# EAGLE design Quad (EAGLE 9.3.1)

## Sheet 1 of 2
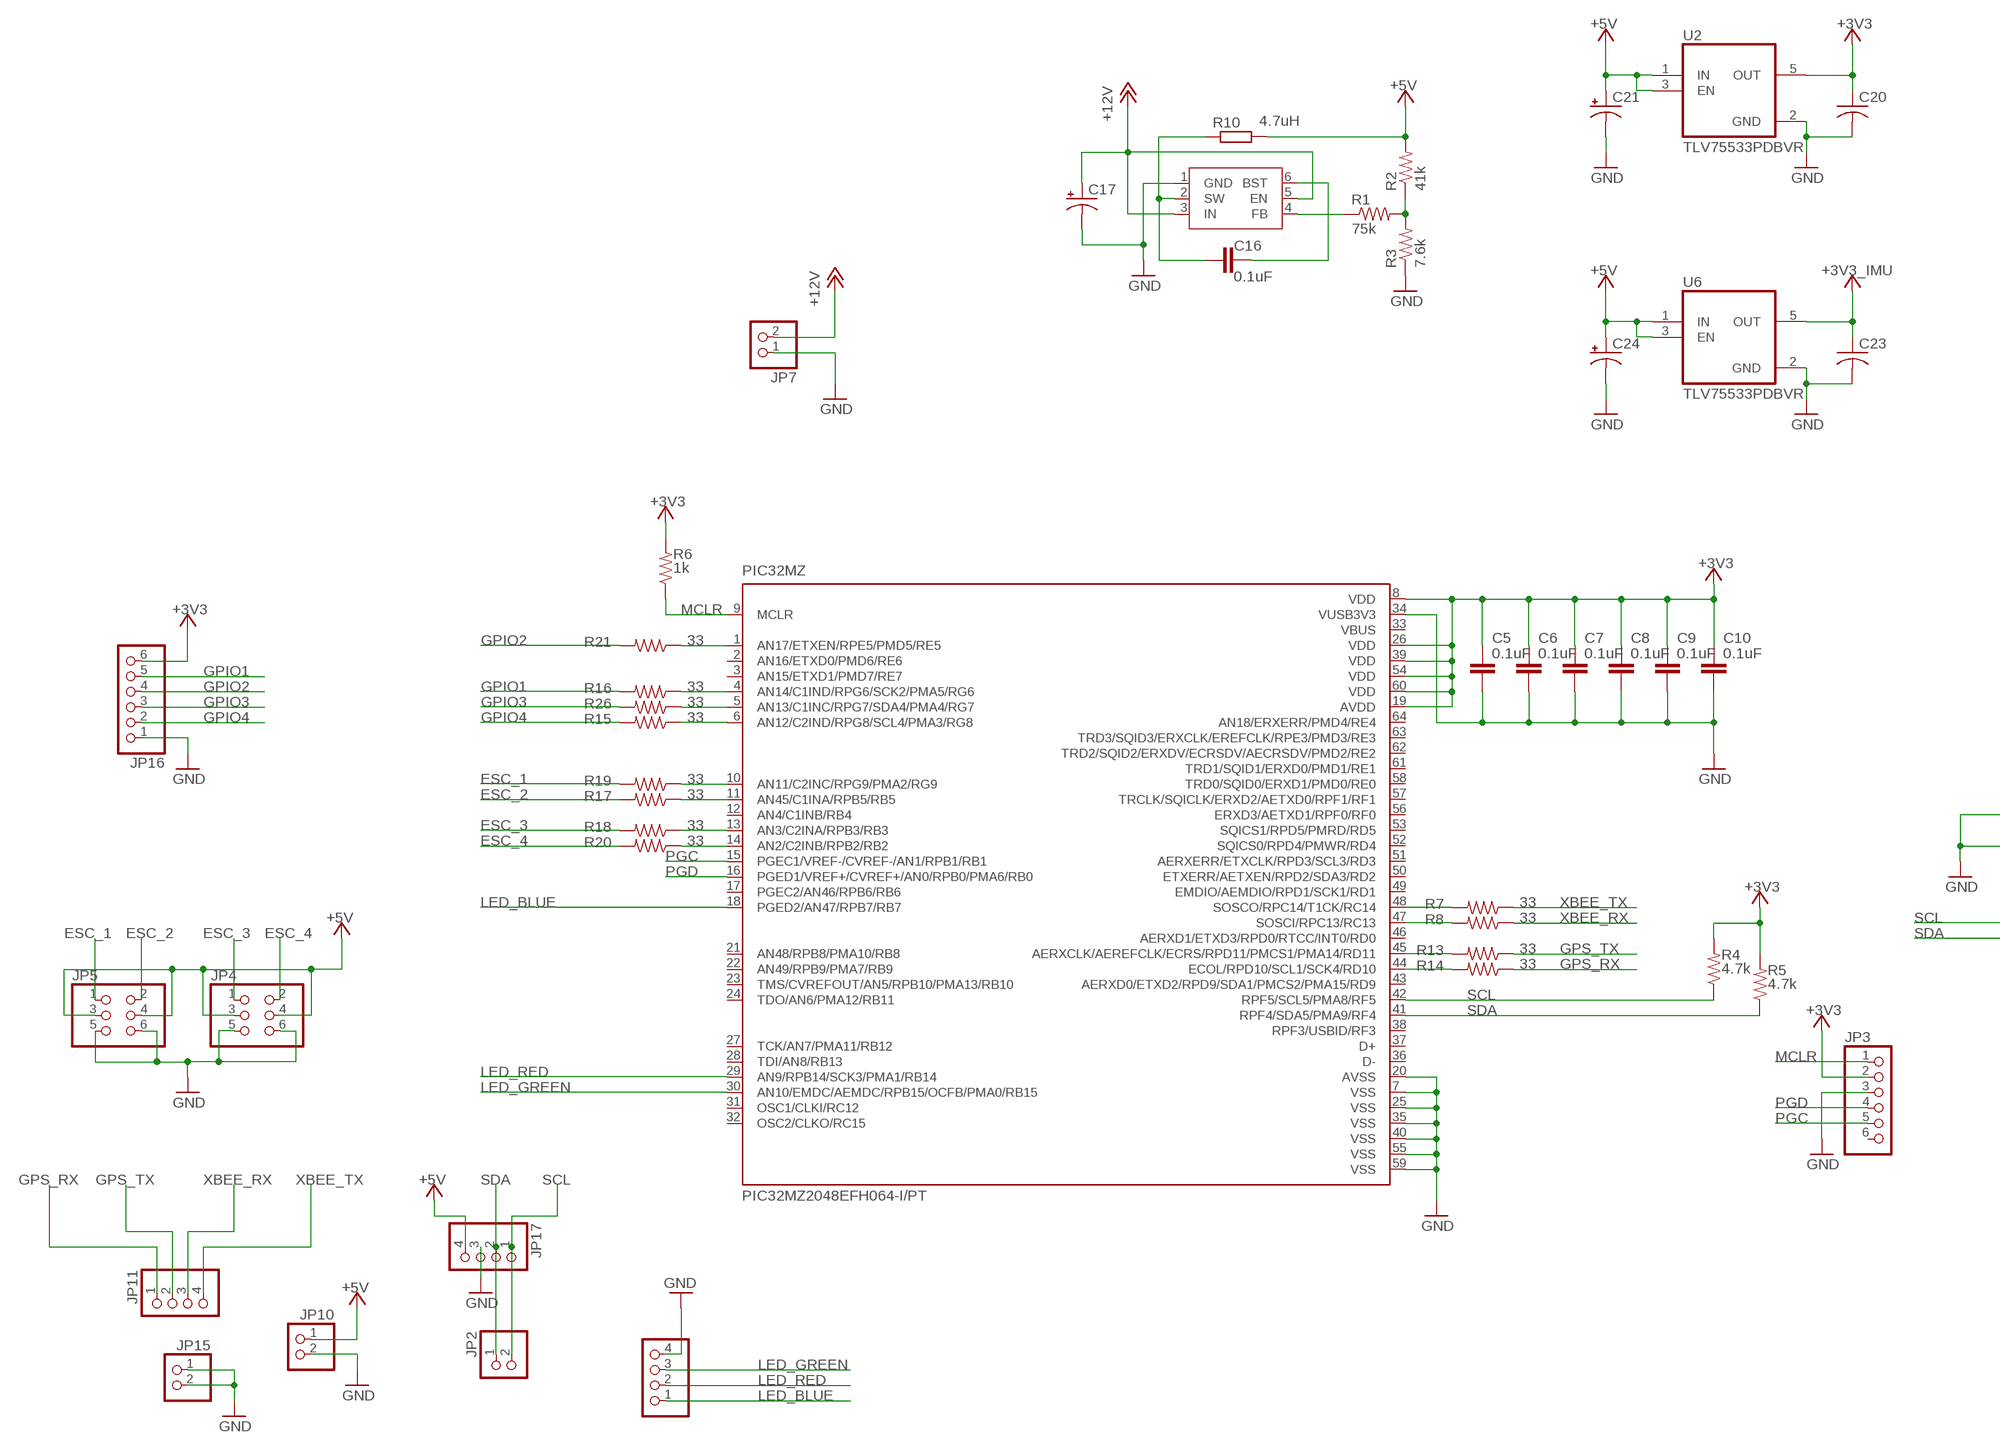
[diagram p0: schematic, sheet 1, part 1 of 2]
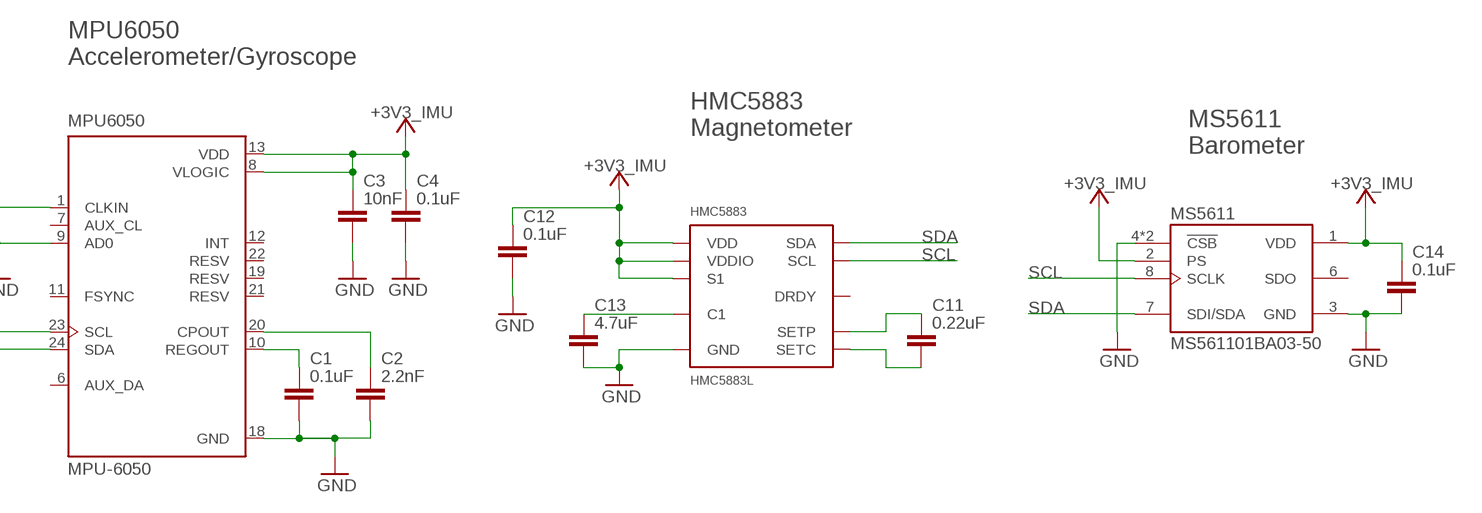
[diagram p1: schematic, sheet 1, part 2 of 2]

### Parts
C1  0.1uF  C-EUC0603  [C0603]
C2  2.2nF  C-EUC0603  [C0603]
C3  10nF  C-EUC0603  [C0603]
C4  0.1uF  C-EUC0603  [C0603]
C5  0.1uF  C-EUC0603  [C0603]
C6  0.1uF  C-EUC0603  [C0603]
C7  0.1uF  C-EUC0603  [C0603]
C8  0.1uF  C-EUC0603  [C0603]
C9  0.1uF  C-EUC0603  [C0603]
C10  0.1uF  C-EUC0603  [C0603]
C11  0.22uF  C-EUC0603  [C0603]
C12  0.1uF  C-EUC0603  [C0603]
C13  4.7uF  C-EUC0603  [C0603]
C14  0.1uF  C-EUC0603  [C0603]
C16  0.1uF  C-EUC0603  [C0603]
C17  CPOL-USC/6032-28R  [C/6032-28R]
C20  C-USC0805  [C0805]
C21  CPOL-USB/3528-21W  [B/3528-21W]
C23  C-USC0805  [C0805]
C24  CPOL-USB/3528-21W  [B/3528-21W]
HMC5883  HMC5883L  [LPCC-16]
JP2  PINHD-1X2  [1X02]
JP3  PINHD-1X6/90  [1X06/90]
JP4  PINHD-2X3  [2X03]
JP5  PINHD-2X3  [2X03]
JP7  PINHD-1X2/90  [1X02/90]
JP9  PINHD-1X4  [1X04]
JP10  PINHD-1X2  [1X02]
JP11  PINHD-1X4  [1X04]
JP15  PINHD-1X2  [1X02]
JP16  PINHD-1X6  [1X06]
JP17  PINHD-1X4/90  [1X04/90]
MPU6050  MPU-6050  [QFN50P400X400X95-24N]
MS5611  MS561101BA03-50  [SON125P500X300X100-8N]
PIC32MZ  PIC32MZ2048EFH064-I/PT  [QFP50P1200X1200X120-64N]
R1  75k  R-US_R0603  [R0603]
R2  41k  R-US_R0603  [R0603]
R3  7.6k  R-US_R0603  [R0603]
R4  4.7k  R-US_R0603  [R0603]
R5  4.7k  R-US_R0603  [R0603]
R6  1k  R-US_R0603  [R0603]
R7  33  R-US_R0603  [R0603]
R8  33  R-US_R0603  [R0603]
R10  4.7uH  R-EU_R0805  [R0805]
R13  33  R-US_R0603  [R0603]
R14  33  R-US_R0603  [R0603]
R15  33  R-US_R0603  [R0603]
R16  33  R-US_R0603  [R0603]
R17  33  R-US_R0603  [R0603]
R18  33  R-US_R0603  [R0603]
R19  33  R-US_R0603  [R0603]
R20  33  R-US_R0603  [R0603]
R21  33  R-US_R0603  [R0603]
R26  33  R-US_R0603  [R0603]
U2  TLV75533PDBVR  [SOT95P280X145-5N]
U6  TLV75533PDBVR  [SOT95P280X145-5N]
U$2  AP65211A  [SOT95P280X140-6N]

### Nets
+3V3: C5.1 C6.1 C7.1 C8.1 C9.1 C10.1 C20.1 JP3.2 JP16.6 PIC32MZ.8(VDD) PIC32MZ.19(AVDD) PIC32MZ.26(VDD) PIC32MZ.39(VDD) PIC32MZ.54(VDD) PIC32MZ.60(VDD) R4.2 R5.2 R6.2 U2.5(OUT)
+5V: C21.+ C24.+ JP4.3 JP4.4 JP5.3 JP5.4 JP10.1 JP17.4 R2.2 R10.2 U2.1(IN) U2.3(EN) U6.1(IN) U6.3(EN)
+12V: C17.+ JP7.2 U$2.3(IN) U$2.5(EN)
ESC_1: JP5.1 R19.2
ESC_2: JP5.2 R17.2
ESC_3: JP4.1 R18.2
ESC_4: JP4.2 R20.2
GND: C1.2 C2.2 C3.2 C4.2 C5.2 C6.2 C7.2 C8.2 C9.2 C10.2 C12.2 C13.2 C14.2 C17.- C20.2 C21.- C23.2 C24.- HMC5883.9(GND) HMC5883.11(GND) JP3.3 JP4.5 JP4.6 JP5.5 JP5.6 JP7.1 JP9.4 JP10.2 JP15.1 JP15.2 JP16.1 JP17.3 MPU6050.1(CLKIN) MPU6050.9(AD0) MPU6050.18(GND) MS5611.3(GND) MS5611.4(!CSB) MS5611.5(!CSB) PIC32MZ.7(VSS) PIC32MZ.20(AVSS) PIC32MZ.25(VSS) PIC32MZ.34(VUSB3V3) PIC32MZ.35(VSS) PIC32MZ.40(VSS) PIC32MZ.55(VSS) PIC32MZ.59(VSS) R3.1 U2.2(GND) U6.2(GND) U$2.1(GND)
GPIO1: JP16.5 R16.2
GPIO2: JP16.4 R21.2
GPIO3: JP16.3 R26.2
GPIO4: JP16.2 R15.2
GPS_RX: JP11.1 R14.1
GPS_TX: JP11.2 R13.1
LED_BLUE: JP9.1 PIC32MZ.18(PGED2/AN47/RPB7/RB7)
LED_GREEN: JP9.3 PIC32MZ.30(AN10/EMDC/AEMDC/RPB15/OCFB/PMA0/RB15)
LED_RED: JP9.2 PIC32MZ.29(AN9/RPB14/SCK3/PMA1/RB14)
MCLR: JP3.1 PIC32MZ.9(MCLR) R6.1
N$1: C1.1 MPU6050.10(REGOUT)
N$2: C2.1 MPU6050.20(CPOUT)
N$3: C11.1 HMC5883.8(SETP)
N$4: C11.2 HMC5883.12(SETC)
N$6: C13.1 HMC5883.10(C1)
N$8: C16.1 R10.1 U$2.2(SW)
N$9: C16.2 U$2.6(BST)
N$10: R1.1 U$2.4(FB)
N$11: R1.2 R2.1 R3.2
N$12: PIC32MZ.48(SOSCO/RPC14/T1CK/RC14) R7.2
N$13: PIC32MZ.47(SOSCI/RPC13/RC13) R8.2
N$18: PIC32MZ.45(AERXCLK/AEREFCLK/ECRS/RPD11/PMCS1/PMA14/RD11) R13.2
N$19: PIC32MZ.44(ECOL/RPD10/SCL1/SCK4/RD10) R14.2
N$21: PIC32MZ.4(AN14/C1IND/RPG6/SCK2/PMA5/RG6) R16.1
N$22: PIC32MZ.1(AN17/ETXEN/RPE5/PMD5/RE5) R21.1
N$23: PIC32MZ.11(AN45/C1INA/RPB5/RB5) R17.1
N$24: PIC32MZ.13(AN3/C2INA/RPB3/RB3) R18.1
N$25: PIC32MZ.10(AN11/C2INC/RPG9/PMA2/RG9) R19.1
N$26: PIC32MZ.14(AN2/C2INB/RPB2/RB2) R20.1
N$30: PIC32MZ.5(AN13/C1INC/RPG7/SDA4/PMA4/RG7) R26.1
N$31: PIC32MZ.6(AN12/C2IND/RPG8/SCL4/PMA3/RG8) R15.1
PGC: JP3.5 PIC32MZ.15(PGEC1/VREF-/CVREF-/AN1/RPB1/RB1)
PGD: JP3.4 PIC32MZ.16(PGED1/VREF+/CVREF+/AN0/RPB0/PMA6/RB0)
SCL: HMC5883.1(SCL) JP2.2 JP17.1 MPU6050.23(SCL) MS5611.8(SCLK) PIC32MZ.42(RPF5/SCL5/PMA8/RF5) R4.1
SDA: HMC5883.16(SDA) JP2.1 JP17.2 MPU6050.24(SDA) MS5611.7(SDI/SDA) PIC32MZ.41(RPF4/SDA5/PMA9/RF4) R5.1
VCC: C3.1 C4.1 C12.1 C14.1 C23.1 HMC5883.2(VDD) HMC5883.4(S1) HMC5883.13(VDDIO) MPU6050.8(VLOGIC) MPU6050.13(VDD) MS5611.1(VDD) MS5611.2(PS) U6.5(OUT) ; supply symbol labelled +3V3_IMU
XBEE_RX: JP11.3 R8.1
XBEE_TX: JP11.4 R7.1
Unconnected: HMC5883.15(DRDY) JP3.6 MPU6050.6(AUX_DA) MPU6050.7(AUX_CL) MPU6050.11(FSYNC) MPU6050.12(INT) MPU6050.19(RESV) MPU6050.21(RESV) MPU6050.22(RESV) MS5611.6(SDO) PIC32MZ.2(AN16/ETXD0/PMD6/RE6) PIC32MZ.3(AN15/ETXD1/PMD7/RE7) PIC32MZ.12(AN4/C1INB/RB4) PIC32MZ.17(PGEC2/AN46/RPB6/RB6) PIC32MZ.21(AN48/RPB8/PMA10/RB8) PIC32MZ.22(AN49/RPB9/PMA7/RB9) PIC32MZ.23(TMS/CVREFOUT/AN5/RPB10/PMA13/RB10) PIC32MZ.24(TDO/AN6/PMA12/RB11) PIC32MZ.27(TCK/AN7/PMA11/RB12) PIC32MZ.28(TDI/AN8/RB13) PIC32MZ.31(OSC1/CLKI/RC12) PIC32MZ.32(OSC2/CLKO/RC15) PIC32MZ.36(D-) PIC32MZ.37(D+) PIC32MZ.38(RPF3/USBID/RF3) PIC32MZ.43(AERXD0/ETXD2/RPD9/SDA1/PMCS2/PMA15/RD9) PIC32MZ.46(AERXD1/ETXD3/RPD0/RTCC/INT0/RD0) PIC32MZ.49(EMDIO/AEMDIO/RPD1/SCK1/RD1) PIC32MZ.50(ETXERR/AETXEN/RPD2/SDA3/RD2) PIC32MZ.51(AERXERR/ETXCLK/RPD3/SCL3/RD3) PIC32MZ.52(SQICS0/RPD4/PMWR/RD4) PIC32MZ.53(SQICS1/RPD5/PMRD/RD5) PIC32MZ.56(ERXD3/AETXD1/RPF0/RF0) PIC32MZ.57(TRCLK/SQICLK/ERXD2/AETXD0/RPF1/RF1) PIC32MZ.58(TRD0/SQID0/ERXD1/PMD0/RE0) PIC32MZ.61(TRD1/SQID1/ERXD0/PMD1/RE1) PIC32MZ.62(TRD2/SQID2/ERXDV/ECRSDV/AECRSDV/PMD2/RE2) PIC32MZ.63(TRD3/SQID3/ERXCLK/EREFCLK/RPE3/PMD3/RE3) PIC32MZ.64(AN18/ERXERR/PMD4/RE4)

### Notes on the sheet
- MPU6050
  Accelerometer/Gyroscope
- HMC5883
  Magnetometer
- MS5611
  Barometer

## Sheet 2 of 2
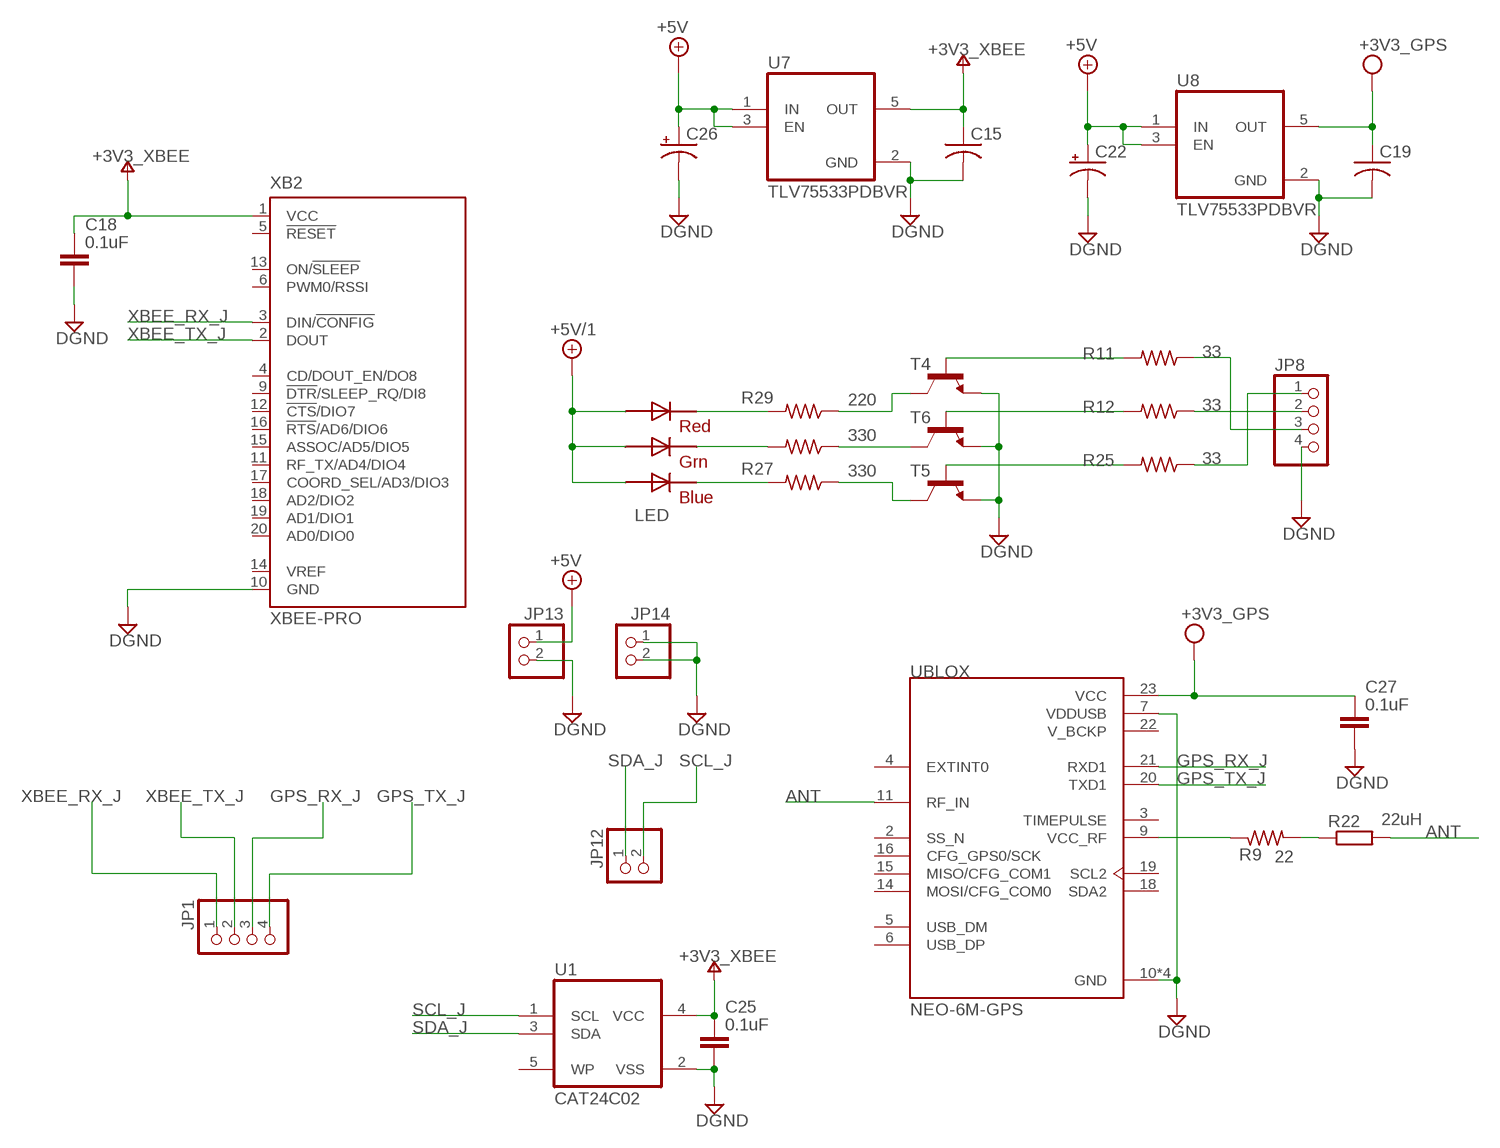
[diagram p2: schematic, sheet 2]

### Parts
C15  C-USC0805  [C0805]
C18  0.1uF  C-EUC0603  [C0603]
C19  C-USC0805  [C0805]
C22  CPOL-USB/3528-21W  [B/3528-21W]
C25  0.1uF  C-EUC0603  [C0603]
C26  CPOL-USB/3528-21W  [B/3528-21W]
C27  0.1uF  C-EUC0603  [C0603]
JP1  PINHD-1X4  [1X04]
JP8  PINHD-1X4  [1X04]
JP12  PINHD-1X2  [1X02]
JP13  PINHD-1X2  [1X02]
JP14  PINHD-1X2  [1X02]
LED  RGBLED5050  [RGBLED5050]
R9  22  R-US_R0603  [R0603]
R11  33  R-US_R0603  [R0603]
R12  33  R-US_R0603  [R0603]
R22  22uH  R-EU_R0805  [R0805]
R25  33  R-US_R0603  [R0603]
R27  330  R-US_R0603  [R0603]
R28  330  R-US_R0603  [R0603]
R29  220  R-US_R0603  [R0603]
T4  -NPN-SOT23-EBC  [SOT23-EBC]
T5  -NPN-SOT23-EBC  [SOT23-EBC]
T6  -NPN-SOT23-EBC  [SOT23-EBC]
U1  CAT24C02  [SOT95P280X145-5N]
U7  TLV75533PDBVR  [SOT95P280X145-5N]
U8  TLV75533PDBVR  [SOT95P280X145-5N]
UBLOX  NEO-6M-GPS  [XCVR_NEO-6M-GPS]
XB2  XBEE-PRO  [XBEE-PRO]

### Nets
+5V/1: C22.+ C26.+ JP13.1 LED.1(GREEN_A) LED.2(RED_A) LED.3(BLUE_A) U7.1(IN) U7.3(EN) U8.1(IN) U8.3(EN) ; supply symbol labelled +5V
ANT: R22.2 UBLOX.11(RF_IN)
DGND: C15.2 C18.2 C19.2 C22.- C25.2 C26.- C27.2 JP8.4 JP13.2 JP14.1 JP14.2 T4.E T5.E T6.E U1.2(VSS) U7.2(GND) U8.2(GND) UBLOX.7(VDDUSB) UBLOX.10(GND) UBLOX.12(GND) UBLOX.13(GND) UBLOX.24(GND) XB2.10(GND)
GPS_RX_J: JP1.3 UBLOX.21(RXD1)
GPS_TX_J: JP1.4 UBLOX.20(TXD1)
LED_BLUE1: R25.2 T5.B
LED_GREEN1: R11.2 T4.B
LED_RED1: R12.2 T6.B
N$5: LED.5(RED_C) R29.2
N$7: LED.6(GREEN_C) R28.2
N$14: R9.2 R22.1
N$15: LED.4(BLUE_C) R27.2
N$16: R9.1 UBLOX.9(VCC_RF)
N$17: JP8.2 R12.1
N$20: JP8.3 R11.1
N$41: JP8.1 R25.1
N$42: R28.1 T6.C
N$43: R29.1 T4.C
N$44: R27.1 T5.C
SCL_J: JP12.2 U1.1(SCL)
SDA_J: JP12.1 U1.3(SDA)
V+: C15.1 C18.1 C25.1 U1.4(VCC) U7.5(OUT) XB2.1(VCC) ; supply symbol labelled +3V3_XBEE
VDD: C19.1 C27.1 U8.5(OUT) UBLOX.23(VCC) ; supply symbol labelled +3V3_GPS
XBEE_RX_J: JP1.1 XB2.3(DIN/!CONFIG)
XBEE_TX_J: JP1.2 XB2.2(DOUT)
Unconnected: U1.5(WP) UBLOX.2(SS_N) UBLOX.3(TIMEPULSE) UBLOX.4(EXTINT0) UBLOX.5(USB_DM) UBLOX.6(USB_DP) UBLOX.14(MOSI/CFG_COM0) UBLOX.15(MISO/CFG_COM1) UBLOX.16(CFG_GPS0/SCK) UBLOX.18(SDA2) UBLOX.19(SCL2) XB2.4(CD/DOUT_EN/DO8) XB2.5(!RESET) XB2.6(PWM0/RSSI) XB2.9(!DTR!/SLEEP_RQ/DI8) XB2.11(RF_TX/AD4/DIO4) XB2.12(!CTS!/DIO7) XB2.13(ON/!SLEEP) XB2.14(VREF) XB2.15(ASSOC/AD5/DIO5) XB2.16(!RTS!/AD6/DIO6) XB2.17(COORD_SEL/AD3/DIO3) XB2.18(AD2/DIO2) XB2.19(AD1/DIO1) XB2.20(AD0/DIO0)

## Power pins joined to a net without a drawn wire
V_BCKP: UBLOX.22(V_BCKP)
VBUS: PIC32MZ.33(VBUS)

## Library data of the parts
C1-C14 C16 C18 C25 C27 = rcl:C-EU: CAPACITOR, European symbol; SPICEPREFIX: C
C15 C19 C20 C23 = rcl:C-US: CAPACITOR, American symbol; SPICEPREFIX: C
C17 C21 C22 C24 C26 = rcl:CPOL-US: POLARIZED CAPACITOR, American symbol; SPICEPREFIX: C
HMC5883 = HMC5883L:HMC5883L; AVAILABILITY: Unavailable; DESCRIPTION: Digital Compass +/- 0.8g, Lcc-16; MF: Honeywell Aerospace; MP: HMC5883L-T; PACKAGE: LCC-16 Honeywell; PRICE: None
JP1 JP8 JP9 JP11 JP17 = pinhead:PINHD-1X4: PIN HEADER
JP2 JP7 JP10 JP12-JP15 = pinhead:PINHD-1X2: PIN HEADER
JP3 JP16 = pinhead:PINHD-1X6: PIN HEADER
JP4 JP5 = pinhead:PINHD-2X3: PIN HEADER
LED = adafruit:RGBLED: For 5050 RGB LEDs, the order of the LEDs may vary from one manufacturer to another!
MPU6050 = MPU-6050:MPU-6050: MPU-6050 Six-Axis (Gyro + Accelerometer) MEMS MotionTracking™ Devices; AVAILABILITY: Unavailable; DESCRIPTION: 3-axis gyroscope, 3-axis accelerometer in a 4x4x0.9 housing; MF: TDK InvenSense; MP: MPU-6050; PACKAGE: QFN-24 InvenSense; PRICE: None
MS5611 = MS561101BA03-50:MS561101BA03-50: BAROMETRIC PRESSURE SENSOR; AVAILABILITY: Unavailable; DESCRIPTION: Pressure Sensor 1.44V to 3.6V 0.01bar to 1.2bar Absolute 8-Pin QFN T/R; MF: TE Connectivity; MP: MS561101BA03-50; PACKAGE: SMD-8 Measurement Specialties; PRICE: None
PIC32MZ = PIC32MZ2048EFH064-I_PT:PIC32MZ2048EFH064-I/PT: PIC32MZ Series 2 MB Flash 512 kB RAM 200 MHz 32-Bit Microcontroller - TQFP-64; DESCRIPTION: PIC32MZ Series 2 MB Flash 512 kB RAM 200 MHz 32-Bit Microcontroller - TQFP-64; DIGI-KEY_PART_NUMBER: PIC32MZ2048EFH064-I/PT-ND; DIGI-KEY_PURCHASE_URL: https://www.digikey.com/product-detail/en/microchip-technology/PIC32MZ2048EFH064-I-PT/PIC32MZ2048EFH064-I-PT-ND/5323563?utm_source=snapeda&utm_medium=aggregator&utm_campaign=symbol; MF: Microchip; MP: PIC32MZ2048EFH064-I/PT; PACKAGE: TQFP-64 Microchip
R1-R9 R11-R21 R25-R29 = rcl:R-US_: RESISTOR, American symbol; SPICEPREFIX: R
R10 R22 = rcl:R-EU_: RESISTOR, European symbol; SPICEPREFIX: R
T4-T6 = transistor:*-NPN-: NPN Transistror BF959 corrected 2008.03.06
U1 = CAT24C02:CAT24C02: 500mA Low-IQ Small-Size Low-Dropout (LDO) Regulator 5-SOT-23 -40 to 125; AVAILABILITY: Unavailable; DESCRIPTION: 500mA Low-IQ Small-Size Low-Dropout _LDO_ Regulator 5-SOT-23 -40 to 125; MF: Texas Instruments; MP: TLV75533PDBVR; PACKAGE: SOT-23 Texas Instruments; PRICE: None
U2 U6-U8 = TLV75533PDBVR:TLV75533PDBVR: 500mA Low-IQ Small-Size Low-Dropout (LDO) Regulator 5-SOT-23 -40 to 125; AVAILABILITY: Unavailable; DESCRIPTION: 500mA Low-IQ Small-Size Low-Dropout _LDO_ Regulator 5-SOT-23 -40 to 125; MF: Texas Instruments; MP: TLV75533PDBVR; PACKAGE: SOT-23 Texas Instruments; PRICE: None
U$2 = SOT95P280X140-6N:AP65211A
UBLOX = NEO-6M-GPS:NEO-6M-GPS: SMD GPS Module;; AVAILABILITY: Unavailable; DESCRIPTION: SMD GPS Module;; MF: u-blox; MP: NEO-6M-GPS; PACKAGE: None; PRICE: None
XB2 = maxstream:XBEE: XBee (TM) /XBee-PRO(TM) OEM RF Modules Source: MaxStream, Inc. xbee_productmanual.pdf; MPN: XBP24-AWI-001; OC_FARNELL: 1337916; OC_NEWARK: 42M2667

## Board
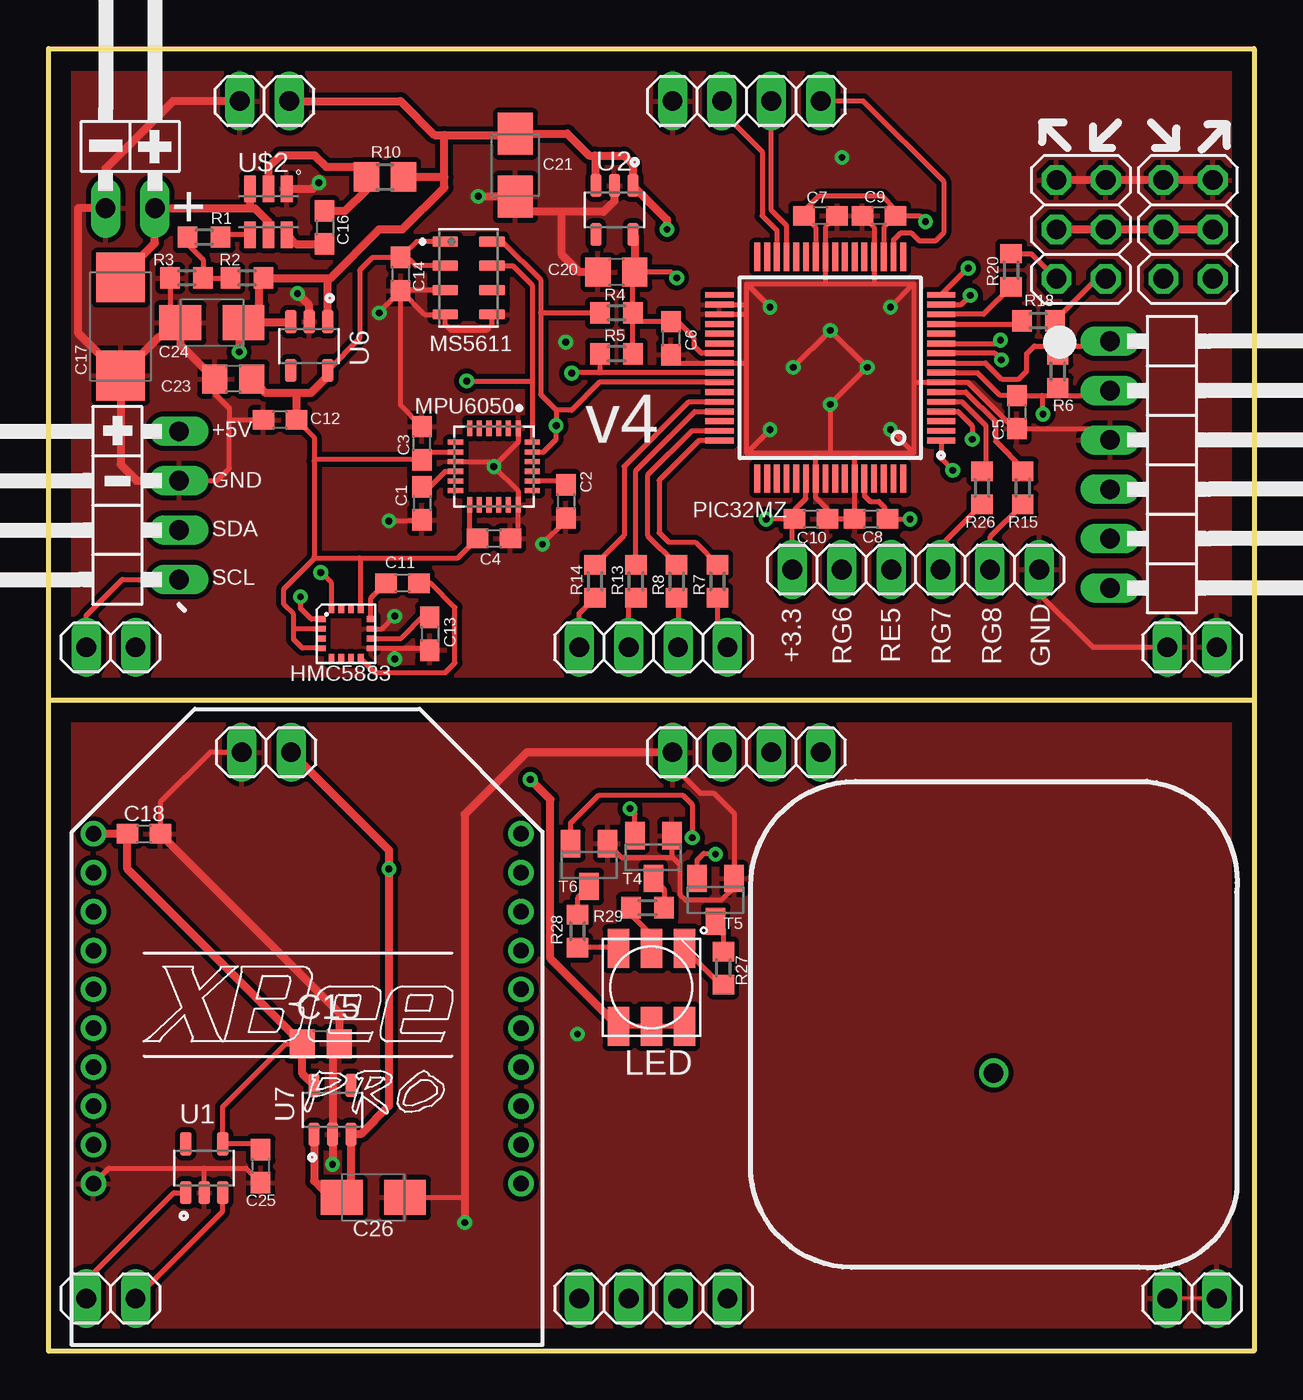
[diagram p3: board, top side]
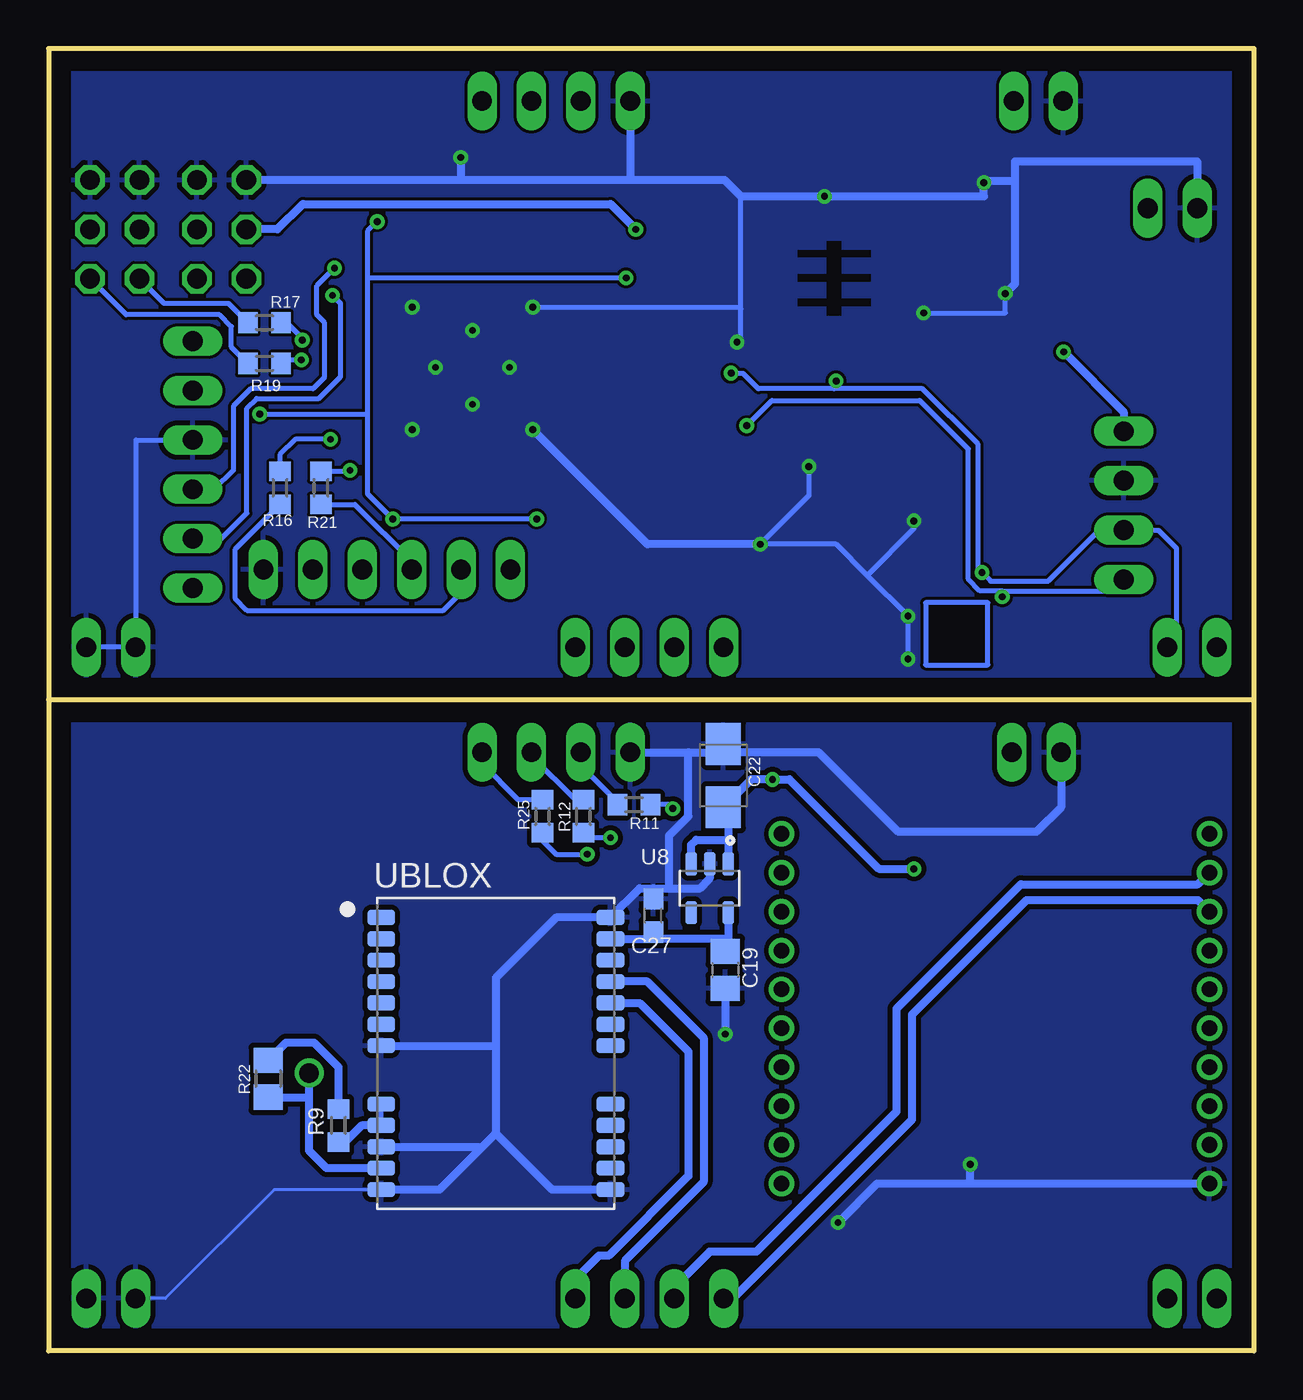
[diagram p4: board, bottom side, seen from below]

Size 62 x 67 mm. Coordinates in mm from the lower left corner, seen from the top.
Outline: 0,33.5 0,67 62,67 62,33.5
Outline: 0,33.5 0,0 62,0 62,33.5
Outline: 0,33.5 62,33.5
Copper layers (1*16): Top 0.035mm / dielectric 1.5mm / Bottom 0.035mm
Design rules "default": minimum track width 6mil, minimum drill 0.35mm, track to track 6mil, track to pad 6mil, pad to pad 6mil, via to via 6mil, smd to smd 6mil, copper to edge 40mil, drill to drill 6mil, minimum pad ring 10mil, minimum via ring 8mil, stop-mask expansion 4mil, vias tented up to drill 0mil, thermal gap 10mil

### Footprints (pad centres in the part's own frame; a part is rotated, then mirrored left to right if it is on the bottom)
C0603 = smd 1.1 x 1: 1 -0.85,0; 2 0.85,0
C0805 = smd 1.3 x 1.5: 1 -0.95,0; 2 0.95,0
C/6032-28R = smd 2.55 x 2.5: + 2.525,0; - -2.525,0
B/3528-21W = smd 2.15 x 1.8: + 1.625,0; - -1.625,0
LPCC-16 = smd 0.45 x 0.3: 1 -1.275,0.75; 2 -1.275,0.25; 3 -1.275,-0.25; 4 -1.275,-0.75; 9 1.275,-0.75; 10 1.275,-0.25; 11 1.275,0.25; 12 1.275,0.75 | smd 0.3 x 0.45: 5 -0.75,-1.275; 6 -0.25,-1.275; 7 0.25,-1.275; 8 0.75,-1.275; 13 0.75,1.275; 14 0.25,1.275; 15 -0.25,1.275; 16 -0.75,1.275
1X04 = drill 1.016 long: 1 -3.81,0; 2 -1.27,0; 3 1.27,0; 4 3.81,0
1X02 = drill 1.016 long: 1 -1.27,0; 2 1.27,0
1X06/90 = drill 1.016 long: 1 -6.35,-3.81; 2 -3.81,-3.81; 3 -1.27,-3.81; 4 1.27,-3.81; 5 3.81,-3.81; 6 6.35,-3.81
2X03 = drill 1.016 octagon: 1 -2.54,-1.27; 2 -2.54,1.27; 3 0,-1.27; 4 0,1.27; 5 2.54,-1.27; 6 2.54,1.27
1X02/90 = drill 1.016 long: 1 -1.27,-3.81; 2 1.27,-3.81
1X06 = drill 1.016 long: 1 -6.35,0; 2 -3.81,0; 3 -1.27,0; 4 1.27,0; 5 3.81,0; 6 6.35,0
1X04/90 = drill 1.016 long: 1 -3.81,-3.81; 2 -1.27,-3.81; 3 1.27,-3.81; 4 3.81,-3.81
RGBLED5050 = smd 2 x 1.1: 1 -2,1.7; 2 -2,0; 3 -2,-1.7; 4 2,-1.7; 5 2,0; 6 2,1.7
QFN50P400X400X95-24N = smd 0.79 x 0.26: 1 -1.97,1.25; 2 -1.97,0.75; 3 -1.97,0.25; 4 -1.97,-0.25; 5 -1.97,-0.75; 6 -1.97,-1.25; 13 1.97,-1.25; 14 1.97,-0.75; 15 1.97,-0.25; 16 1.97,0.25; 17 1.97,0.75; 18 1.97,1.25 | smd 0.26 x 0.79: 7 -1.25,-1.97; 8 -0.75,-1.97; 9 -0.25,-1.97; 10 0.25,-1.97; 11 0.75,-1.97; 12 1.25,-1.97; 19 1.25,1.97; 20 0.75,1.97; 21 0.25,1.97; 22 -0.25,1.97; 23 -0.75,1.97; 24 -1.25,1.97
SON125P500X300X100-8N = smd 1.31 x 0.53: 1 -1.2,1.875; 2 -1.2,0.625; 3 -1.2,-0.625; 4 -1.2,-1.875; 5 1.2,-1.875; 6 1.2,-0.625; 7 1.2,0.625; 8 1.2,1.875
QFP50P1200X1200X120-64N = smd 1.45 x 0.3: 1 -5.7,3.75; 2 -5.7,3.25; 3 -5.7,2.75; 4 -5.7,2.25; 5 -5.7,1.75; 6 -5.7,1.25; 7 -5.7,0.75; 8 -5.7,0.25; 9 -5.7,-0.25; 10 -5.7,-0.75; 11 -5.7,-1.25; 12 -5.7,-1.75; 13 -5.7,-2.25; 14 -5.7,-2.75; 15 -5.7,-3.25; 16 -5.7,-3.75; 33 5.7,-3.75; 34 5.7,-3.25; 35 5.7,-2.75; 36 5.7,-2.25; 37 5.7,-1.75; 38 5.7,-1.25; 39 5.7,-0.75; 40 5.7,-0.25; 41 5.7,0.25; 42 5.7,0.75; 43 5.7,1.25; 44 5.7,1.75; 45 5.7,2.25; 46 5.7,2.75; 47 5.7,3.25; 48 5.7,3.75 | smd 0.3 x 1.45: 17 -3.75,-5.7; 18 -3.25,-5.7; 19 -2.75,-5.7; 20 -2.25,-5.7; 21 -1.75,-5.7; 22 -1.25,-5.7; 23 -0.75,-5.7; 24 -0.25,-5.7; 25 0.25,-5.7; 26 0.75,-5.7; 27 1.25,-5.7; 28 1.75,-5.7; 29 2.25,-5.7; 30 2.75,-5.7; 31 3.25,-5.7; 32 3.75,-5.7; 49 3.75,5.7; 50 3.25,5.7; 51 2.75,5.7; 52 2.25,5.7; 53 1.75,5.7; 54 1.25,5.7; 55 0.75,5.7; 56 0.25,5.7; 57 -0.25,5.7; 58 -0.75,5.7; 59 -1.25,5.7; 60 -1.75,5.7; 61 -2.25,5.7; 62 -2.75,5.7; 63 -3.25,5.7; 64 -3.75,5.7
R0603 = smd 1 x 1.1: 1 -0.85,0; 2 0.85,0
R0805 = smd 1.3 x 1.5: 1 -0.95,0; 2 0.95,0
SOT23-EBC = smd 1 x 1.4: B 0.95,-1.1; C 0,1.1; E -0.95,-1.1
SOT95P280X145-5N = smd 1.21 x 0.59: 1 -1.255,0.95; 2 -1.255,0; 3 -1.255,-0.95; 4 1.255,-0.95; 5 1.255,0.95
SOT95P280X140-6N = smd 1.35 x 0.6: 1 -1.185,0.95; 2 -1.185,0; 3 -1.185,-0.95; 4 1.185,-0.95; 5 1.185,0; 6 1.185,0.95
XCVR_NEO-6M-GPS = smd 1.44 x 0.79: 1 -5.895,7; 2 -5.895,5.9; 3 -5.895,4.8; 4 -5.895,3.7; 5 -5.895,2.6; 6 -5.895,1.5; 7 -5.895,0.4; 8 -5.895,-2.6; 9 -5.895,-3.7; 10 -5.895,-4.8; 11 -5.895,-5.9; 12 -5.895,-7; 13 5.895,-7; 14 5.895,-5.9; 15 5.895,-4.8; 16 5.895,-3.7; 17 5.895,-2.6; 18 5.895,0.4; 19 5.895,1.5; 20 5.895,2.6; 21 5.895,3.7; 22 5.895,4.8; 23 5.895,5.9; 24 5.895,7
XBEE-PRO = drill 0.8 pad 1.27: 1 -11,9; 2 -11,7; 3 -11,5; 4 -11,3; 5 -11,1; 6 -11,-1; 7 -11,-3; 8 -11,-5; 9 -11,-7; 10 -11,-9; 11 11,-9; 12 11,-7; 13 11,-5; 14 11,-3; 15 11,-1; 16 11,1; 17 11,3; 18 11,5; 19 11,7; 20 11,9

### Placement (x,y rotation side)
C1  19.2,43.6 270 top
C2  26.6,43.7 270 top
C3  19.2,46.7 90 top
C4  22.9,41.8 0 top
C5  49.8,48.3 270 top
C6  32,52.1 270 top
C7  39.7,58.4 0 top
C8  42.3,42.8 180 top
C9  42.7,58.4 180 top
C10  39.2,42.8 0 top
C11  18.2,39.5 180 top
C12  11.9,47.9 180 top
C13  19.6,36.9 270 top
C14  18.1,55.4 270 top
C15  14,15.8 0 top
C16  14.2,57.8 270 top
C17  3.7,52.7 90 top
C18  4.9,26.6 0 top
C19  27.2,19.6 270 bottom
C20  29.2,55.5 180 top
C21  24,61 90 top
C22  27.3,29.6 270 bottom
C23  9.5,50 180 top
C24  8.4,52.9 0 top
C25  10.9,9.5 270 top
C26  16.7,7.9 180 top
C27  30.9,22.4 90 bottom
HMC5883  15.3,36.9 0 top
JP1  31.1,2.7 0 top
JP2  3.2,36.2 180 top
JP3  58.4,45.6 270 top
JP4  53.1,57.7 90 top
JP5  58.6,57.7 90 top
JP7  4.2,62.6 0 top
JP8  35.9,30.8 180 top
JP9  35.9,64.3 180 top
JP10  11.1,64.3 180 top
JP11  31.1,36.2 0 top
JP12  3.2,2.7 180 top
JP13  11.2,30.8 180 top
JP14  58.8,2.7 0 top
JP15  58.8,36.2 0 top
JP16  44.6,40.2 180 top
JP17  2.9,43.5 90 top
LED  31,18.7 90 top
MPU6050  22.9,45.5 270 top
MS5611  21.6,55.2 0 top
PIC32MZ  40.2,50.58 180 top
R1  8,57.3 180 top
R2  10.2,55.2 0 top
R3  7.1,55.2 0 top
R4  29.2,53.4 0 top
R5  29.2,51.3 0 top
R6  51.9,50.4 270 top
R7  34.4,39.6 90 top
R8  32.3,39.6 90 top
R9  47.1,11.6 90 bottom
R10  17.3,60.4 0 top
R11  31.9,28.1 0 bottom
R12  34.5,27.5 270 bottom
R13  30.2,39.6 90 top
R14  28.1,39.6 90 top
R15  50.1,44.4 270 top
R16  50.1,44.4 270 bottom
R17  50.9,52.9 180 bottom
R18  50.9,53 0 top
R19  50.9,50.8 180 bottom
R20  49.5,55.6 90 top
R21  48,44.4 270 bottom
R22  50.7,14 270 bottom
R25  36.6,27.5 270 bottom
R26  48,44.4 270 top
R27  34.7,19.7 270 top
R28  27.2,21.6 270 top
R29  30.8,22.8 180 top
T4  31.1,25.4 180 top
T5  34.3,23.2 180 top
T6  27.8,25 180 top
U1  8,9.4 90 top
U2  29.1,58.7 270 top
U6  13.4,51.7 270 top
U7  14.6,12.4 90 top
U8  28,23.8 270 bottom
U$2  11.3,58.6 270 top
UBLOX  39,15.3 0 bottom
XB2  13.3,17.6 0 top

### Tracks (layer width: path | path; a pad name or v marks a point on that pad's centre or on a via)
+3V3  (via drill 0.35)
  Top 0.254: C6.1 32.15,52.95 | C10.1 38.35,43.25 38.95,43.85 PIC32MZ.54 | PIC32MZ.60 41.95,44 42.25,43.7 42.7,43.7 43,43.4 43,42.8 C8.1 v44.3,42.8 | C10.1 38.35,42.55 | PIC32MZ.26 39.45,57.8 C7.1 38.85,58.65 39.6,59.4 42.9,59.4 43.55,58.75 C9.1 | C9.1 42.95,57.8 PIC32MZ.19 | v32.3,55.2 32,55.5 C20.1 30.05,55.4 R4.2 30.05,53 | v45.1,58.1 44.8,58.4 C9.1 | PIC32MZ.39 33.57,51.33 33.2,51.7 33.2,52.1 32.35,52.95 C6.1 | R5.2 30.05,53 | C6.1 30.1,52.95 30.05,53 | PIC32MZ.8 47.77,50.33 48.95,49.15 C5.1 51.1,49.15 | 51.1,49.15 51.9,49.15 | 51.9,49.15 54.33,49.15 JP3.2 | R6.2 51.9,49.15 | 51.1,49.15 51.1,48.24 v51.14,48.2 | C10.1 v36.9,42.8 | C10.1 38.25,42.7 JP16.6
  Top 0.406: U2.5 30.15,57.34 C20.1
  Bottom 0.254: 45.6,55.2 45.6,48.2 | 45.6,48.2 45.6,44.1 v44.3,42.8 v36.9,42.8 | v32.3,55.2 45.6,55.2 | v45.1,58.1 45.6,57.6 45.6,55.2 | v51.14,48.2 45.6,48.2
+5V  (via drill 0.35)
  Top 0.406: JP4.4 JP4.3 JP5.4 JP5.3 | 20.35,62.55 19.84,62.55 18.1,64.3 JP10.1 | 20.35,62.55 23.93,62.55 C21.+ 26.68,62.62 27.8,61.5 28.1,61.5 | v31.8,57.7 31.8,58.2 U2.1 30.05,61.05 29.6,61.5 28.1,61.5 | U2.3 28.15,61.45 28.1,61.5 | U6.3 12.39,52.9 10.8,52.9 | 10.8,52.9 C24.+ 9.8,52.67 v9.8,51.4 | 10.8,52.9 10.8,54.95 R2.2 14.5,55.2 | 20.35,60.4 20.35,59.85 18.2,57.7 17,57.7 14.5,55.2 | 20.35,60.4 20.35,62.55 | 14.5,55.2 14.35,55.05 U6.1 | R10.2 20.35,60.4
  Bottom 0.406: v31.8,57.7 33.1,59 48.93,59 50.23,57.7 JP4.4 | v9.8,51.4 6.71,48.31 JP17.4
+5V/1  (via drill 0.35)
  Top 0.254: LED.3 LED.2 LED.1
  Top 0.406: 15.55,8.3 U7.3 16.05,11.14 17.5,12.6 v17.5,24.8 17.5,25.77 JP13.1 | 15.55,8.3 15.55,8 15.45,7.9 C26.+ 15.03,7.95 | 15.55,8.3 14.1,8.3 13.65,8.75 U7.1 | LED.1 25.8,20.2 25.8,28.38 v24.77,29.4
  Bottom 0.406: 27.05,26.3 27.05,28.23 C22.+ 25.88,29.4 v24.77,29.4 23.9,29.4 19.3,24.8 v17.5,24.8 | 27.05,26.3 U8.1 | U8.3 28.95,26.05 28.7,26.3 27.05,26.3
+12V
  Top 0.406: 10.27,59.78 U$2.3 10.35,58.84 10.4,58.79 | C17.+ 5.47,57 JP7.2 10.4,58.79 | 10.4,58.79 10.61,58.79 11.3,58.1 U$2.5
ANT  (via drill 1)
  Bottom 0.406: UBLOX.11 47.7,9.4 48.6,10.3 48.6,13 | 48.6,13 v48.6,14.3 | R22.2 48.65,13.05 48.6,13
DGND  (via drill 0.35)
  Top 0.152: JP14.2 JP14.1
  Top 0.254: JP13.2 8.3,30.8 5.75,28.25 C18.2 | T6.E 29.45,25.4 32.1,25.4 | T5.E 35.25,23.85 34.6,23.2 32.76,23.2 32.47,23.48 32.47,25.03 32.1,25.4 | T5.E 35.25,24.85 | JP8.4 32.09,30.11 33.5,28.7 34.2,28.7 35.25,27.65 T5.E | XB2.10 3.1,9.4 8,9.4 | 8,9.4 10.15,9.4 C25.2 | U1.2 8,9.4 | T4.E 32.05,25.45 32.1,25.4 | C26.- 21.4,7.9 21.4,7.8
  Top 0.406: v14.6,9.6 U7.2 14.6,15.45 C15.2 14.95,17.4 C18.2 | JP8.4 24.6,30.8 21.4,27.6 21.4,7.8 v21.4,6.6
  Bottom 0.152: UBLOX.12 50.4,8.3 56,2.7 JP14.1
  Bottom 0.406: 14.6,8.6 v14.6,9.6 | U8.2 28,24.3 28.5,23.8 30.1,23.8 | 30.9,23.8 31.61,23.8 UBLOX.24 35.9,22.3 39,19.2 39,15.7 | 30.9,23.8 30.1,23.8 | 30.1,23.8 30.1,26.5 29.1,27.5 29.1,30.8 | UBLOX.12 41.9,8.3 39.7,10.5 | 39,15.7 39,11.2 | UBLOX.7 39,15.7 | UBLOX.13 36.1,8.3 39,11.2 | UBLOX.10 39.7,10.5 | 39.7,10.5 39,11.2 | C19.2 v27.2,16.3 | C27.2 30.9,23.8 | XB2.10 14.6,8.6 | v21.4,6.6 19.4,8.6 14.6,8.6 | JP13.2 9.93,27.97 11.2,26.7 18.3,26.7 22.4,30.8 26.79,30.8 C22.- 27.73,30.8 29.1,30.8 | JP8.4 29.1,30.8
  pour Top (isolate 0.254): 0,33.5 0,0 62,0 62,33.5
  pour Bottom (isolate 0.254): 0,33.5 0,0 62,0 62,33.5
ESC_1
  Bottom 0.254: R19.2 52.6,51.65 52.6,52.7 53.2,53.3 58.01,53.3 JP5.1
ESC_2
  Bottom 0.254: JP5.2 56.07,53.9 52.75,53.9 R17.2
ESC_3
  Top 0.254: R18.2 53.91,55.16 JP4.1
ESC_4
  Top 0.254: R20.2 50.54,56.45 JP4.2
GND  (via drill 0.35)
  Top 0.254: C12.2 9.3,47.9 | HMC5883.9 17.8,36.15 | 17.8,36.15 19.5,36.15 C13.2 | C14.2 19.32,53.33 MS5611.4 20.4,52.8 20.7,52.5 22.5,52.5 22.8,52.8 MS5611.5 | MS5611.3 18.12,54.58 C14.2 | 39.45,46.2 PIC32MZ.55 39.45,43.9 40.05,43.3 C10.2 C8.2 PIC32MZ.59 41.45,46.2 | 39.45,46.2 35.9,46.2 | 35.9,46.2 35.9,50.83 | 35.9,50.83 35.9,53.33 | 35.9,53.83 35.9,54.9 | 35.9,54.9 39.95,54.9 | 39.95,54.9 42.45,54.9 | 42.45,54.9 44.5,54.9 | 44.5,54.9 44.5,49.83 | 44.5,49.83 44.5,46.2 | 44.5,46.2 41.45,46.2 | 41.45,46.2 40.2,46.2 | 40.2,46.2 39.45,46.2 | 35.9,50.83 PIC32MZ.40 32.42,50.83 C6.2 | PIC32MZ.35 35.9,53.33 | 35.9,53.33 35.9,53.83 | PIC32MZ.34 35.9,53.83 | 39.95,54.9 PIC32MZ.25 39.95,57.8 C7.2 | 42.45,54.9 PIC32MZ.20 42.45,57.8 C9.2 | 44.5,49.83 PIC32MZ.7 47.27,49.83 49.65,47.45 C5.2 54.01,47.45 JP3.3 | v38.3,50.6 v40.2,52.5 v42.1,50.6 v40.2,48.7 40.2,46.2 | v43.3,53.7 44.5,54.9 | v43.3,47.4 44.5,46.2 | v37.1,47.4 35.9,46.2 | v37.1,53.7 35.9,54.9 | C14.2 17,53.45 v17,53.4 | R3.1 6.25,53.42 C24.- | C23.2 8.55,49.25 9.3,48.5 9.3,47.9 | 9.3,47.9 9.3,45.4 8.67,44.77 JP17.3 | HMC5883.11 17.15,37.15 v17.8,37.8 | v17.8,35.6 17.8,36.15 | MPU6050.9 22.65,45.75 v22.9,45.5 | MPU6050.1 24.15,46.75 v22.9,45.5 | v22.9,45.5 24.15,44.25 MPU6050.18 24.15,42.2 C4.2 | C3.2 18.1,48.65 C14.2 | C2.2 26.6,42.7 v25.4,41.5 | C1.2 19.15,42.7 v17.5,42.7 | JP15.1 53.7,36.2 50.95,38.95 JP16.1
  Top 0.406: v13.9,60.1 13.59,59.78 U$2.1 | U6.2 13.4,53.8 v12.8,54.4 | U2.2 29.1,59.16 28.55,58.6 26.4,58.6 | v22.1,59.4 22.12,59.38 C21.- 24.77,58.6 26.4,58.6 | 28.07,55.5 C20.2 27.3,55.5 26.4,56.4 26.4,58.6 | JP5.5 JP5.6 JP4.5 JP4.6 | C24.- 6.78,52.2 | 6.78,52.2 6.78,51.77 C23.2 | 2.73,51.14 C17.- | C17.- 5.72,52.2 6.78,52.2 | C17.- 1.5,52.38 1.5,58.79 JP7.1 2.93,60.83 6.4,64.3 JP10.2 | C17.- 3.7,45.6 4.53,44.77 JP17.3
  Bottom 0.254: v22.9,45.5 22.9,44 v25.4,41.5 21.5,41.5 19.9,39.9 | v12.8,54.4 12.8,53.4 v17,53.4 | 26.4,53.6 26.4,52.1 v26.6,51.9 | 26.4,53.6 26.4,59.4 | v17.8,35.6 v17.8,37.8 19.9,39.9 | v17.5,42.7 17.5,42.3 19.9,39.9 | JP15.2 JP15.1 57.5,36.2 57.5,46.87 JP3.3 | 26.4,53.6 26.5,53.7 v37.1,53.7
  Bottom 0.406: 12.3,60.2 13.8,60.2 v13.9,60.1 13.9,59.4 v22.1,59.4 26.4,59.4 27.24,60.24 32.1,60.24 | JP7.1 2.93,61.2 12.3,61.2 12.3,60.2 | v12.8,54.4 12.3,54.9 12.3,60.2 | v25.4,41.5 v25.41,41.51 31.21,41.51 v37.1,47.4 | 32.1,60.24 40.8,60.24 | 40.8,60.24 JP4.6 | JP9.4 32.09,60.25 32.1,60.24 | v40.8,61.4 40.8,60.24
  pour Top (isolate 0.254): 0,33.5 62,33.5 62,67 0,67
  pour Bottom (rank 2): 0,33.5 0,67 62,67 62,33.5
GPIO1
  Bottom 0.254: R16.2 52.4,41.25 52.4,38.7 51.8,38.1 41.7,38.1 40.79,39.01 JP16.5
GPIO2
  Bottom 0.254: R21.2 46.25,43.55 43.33,40.63 JP16.4
GPIO3
  Top 0.254: JP16.3 45.87,41.42 R26.2
GPIO4
  Top 0.254: R15.2 48.41,41.86 JP16.2
GPS_RX
  Top 0.254: R14.1 27.29,37.94 JP11.1
GPS_RX_J
  Bottom 0.406: UBLOX.21 31.2,19 28.31,16.11 28.31,8.69 32.37,4.63 JP1.3
GPS_TX
  Top 0.254: JP11.2 29.83,38.75 R13.1
GPS_TX_J
  Bottom 0.406: UBLOX.20 31.6,17.9 29.1,15.4 29.1,9 33.2,4.9 33.7,4.9 34.91,3.69 JP1.4
LED_BLUE
  Top 0.254: JP9.1 41.9,64.3 46.02,60.17 46.02,57.52 45.6,57.1 44.8,57.1 44.4,57.5 43.8,57.5 43.45,57.15 PIC32MZ.18
LED_BLUE1  (via drill 0.35)
  Top 0.254: T5.B 33.35,25.25 33.7,25.6 34.25,25.6 v34.3,25.55
  Bottom 0.254: R25.2 36.6,26.25 35.9,25.55 v34.3,25.55
LED_GREEN
  Top 0.254: JP9.3 34.63,63.77 36.7,61.7 36.7,58.4 37.45,57.65 PIC32MZ.30
LED_GREEN1  (via drill 0.35)
  Top 0.254: T4.B 30.15,27.65 v29.9,27.9
  Bottom 0.254: v29.9,27.9 30.1,28.1 R11.2
LED_RED
  Top 0.254: PIC32MZ.29 37.95,57.9 37.17,58.68 JP9.2
LED_RED1  (via drill 0.35)
  Top 0.254: T6.B 26.85,27.15 28.3,28.6 32.6,28.6 33.1,28.1 v33.1,26.4
  Bottom 0.254: v33.1,26.4 34.25,26.4 R12.2
MCLR
  Top 0.254: PIC32MZ.9 48.17,50.83 49,50 49.9,50 50.3,50.4 50.3,51.3 50.7,51.7 51.9,51.7 | JP3.1 54.34,51.7 51.9,51.7 | R6.1 51.9,51.7
N$1
  Top 0.254: C1.1 19.6,44.45 20.4,45.25 MPU6050.10
N$2
  Top 0.254: C2.1 26.57,44.75 MPU6050.20
N$3
  Top 0.254: HMC5883.8 16.77,34.9 20.4,34.9 20.9,35.4 20.9,38.25 19.65,39.5 C11.1
N$4
  Top 0.254: C11.2 16.57,38.73 HMC5883.12
N$5
  Top 0.254: R29.2 29.95,22.45 31,21.4 LED.5
N$6
  Top 0.254: HMC5883.10 18.1,36.65 19.3,37.85 19.5,37.85 C13.1
N$7
  Top 0.254: LED.6 29.25,20.75 R28.2
N$8
  Top 0.406: U$2.2 11.3,60.9 11.9,61.5 13.7,61.5 14.28,60.92 15.83,60.92 R10.1 16.35,59.75 15.25,58.65 C16.1
N$9
  Top 0.406: U$2.6 12.71,56.95 C16.2
N$10
  Top 0.254: U$2.4 8.96,57.41 R1.1
N$11
  Top 0.254: R2.1 R3.2 7.95,56.15 7.15,56.95 R1.2
N$12
  Top 0.254: R7.2 34.1,40.75 | R7.2 34.5,40.55 | PIC32MZ.48 33.43,46.83 31.4,44.8 31.4,42.1 31.9,41.6 33.25,41.6 R7.2
N$13
  Top 0.254: 32.68,40.83 R8.2 30.8,41.95 30.8,45.05 33.08,47.33 PIC32MZ.47
N$14
  Bottom 0.406: R9.2 47.1,14.6 48.35,15.85 49.8,15.85 R22.1
N$15
  Top 0.254: R27.2 34.55,18.85 LED.4
N$16
  Bottom 0.254: UBLOX.9 44.9,12.7
  Bottom 0.406: UBLOX.9 45.9,11.6 46.75,10.75 R9.1
N$17
  Bottom 0.254: JP8.2 37.17,30.62 34.9,28.35 R12.1
N$18
  Top 0.254: PIC32MZ.45 33.23,48.33 30.2,45.3 R13.2
N$19
  Top 0.254: R14.2 29.6,41.95 29.6,45.5 32.93,48.83 PIC32MZ.44
N$20
  Bottom 0.254: R11.1 32.75,28.25 34.63,30.13 JP8.3
N$21  (via drill 0.35)
  Top 0.254: PIC32MZ.4 46.77,48.33 47.5,47.6 v47.5,46.9
  Bottom 0.254: v47.5,46.9 49.3,46.9 50.1,46.1 R16.1
N$22  (via drill 0.35)
  Top 0.254: PIC32MZ.1 45.9,45.9 v46.5,45.3
  Bottom 0.254: v46.5,45.3 46.55,45.25 R21.1
N$23  (via drill 0.35)
  Top 0.254: PIC32MZ.11 48.79,51.83 v48.96,52
  Bottom 0.254: v48.96,52 48.96,52.1 49.76,52.9 R17.1
N$24
  Top 0.254: 49.95,52.9 R18.1 49.88,52.83 PIC32MZ.13
N$25  (via drill 0.35)
  Top 0.254: v49,50.99 48.66,51.33 PIC32MZ.10
  Bottom 0.254: R19.1 49.86,50.99 v49,50.99
N$26
  Top 0.254: R20.1 48.08,53.33 PIC32MZ.14
N$29
  Bottom 0.254: 13.7,38.5 16.9,38.5 16.9,35.3 13.7,35.3 13.7,38.5
N$30
  Top 0.254: PIC32MZ.5 46.97,48.83 48.2,47.6 48.2,46.6 48.2,46.4 48.2,45.45 R26.1
N$31
  Top 0.254: PIC32MZ.6 47.17,49.33 48.7,47.8 48.7,46.8 50.1,45.4 R15.1
N$41
  Bottom 0.254: R25.1 37.85,28.35 39.71,30.21 JP8.1
N$42
  Top 0.254: 27.7,23.8 T6.C 27.2,23.3 R28.1
N$43
  Top 0.254: T4.C 31.65,23.75 R29.1
N$44
  Top 0.254: T5.C 34.7,21.7 R27.1
PGC  (via drill 0.35)
  Top 0.254: PIC32MZ.15 46.93,53.83 v47.4,54.3
  Bottom 0.254: v47.4,54.3 47,53.9 47,50.1 48.1,49 51.3,49 51.8,48.5 51.8,43.1 53.11,41.79 JP3.5
PGD  (via drill 0.35)
  Top 0.254: v47.3,55.7 47.27,55.7 PIC32MZ.16
  Bottom 0.254: v47.3,55.7 48.2,54.8 48.2,53.3 47.8,52.9 47.8,50.1 48.4,49.5 51.6,49.5 52.5,48.6 52.5,45.3 53.47,44.33 JP3.4
SCL  (via drill 0.35)
  Top 0.254: HMC5883.1 13.51,37.65 12.96,38.2 v12.96,38.8 | MS5611.8 23.32,57.08 25.3,55.1 25.3,53.4 | R4.1 25.3,53.4 | PIC32MZ.42 28.33,49.83 26.9,48.4 26.1,48.4 | 25.3,53.4 25.3,49.2 26.1,48.4 | 26.1,48.4 v26.1,47.6 26.1,46.9 25.45,46.25 MPU6050.23 | JP2.2 1.93,37.83 3.79,39.69 JP17.1
  Bottom 0.254: 12.96,39.1 7.3,39.1 JP17.1 | 12.96,39.1 14.1,39.1 14.7,39.7 14.7,46.4 17.2,48.9 24.8,48.9 v26.1,47.6 | 12.96,39.1 v12.96,38.8
SCL_J
  Top 0.254: JP12.2 1.93,3.63 6.45,8.14 U1.1
SDA  (via drill 0.35)
  Top 0.254: HMC5883.16 14.55,39.49 v14,40.04 | MS5611.7 23.88,55.83 24.87,54.83 24.87,49.9 | 24.87,49.9 MPU6050.24 | v21.5,49.9 24.87,49.9 | PIC32MZ.41 28.3,50.33 | 28.3,50.33 26.93,50.33 v26.9,50.3 | R5.1 28.35,50.38 28.3,50.33
  Bottom 0.254: v26.9,50.3 26.3,50.3 25.5,49.5 21.6,49.5 | 21.6,49.5 17.06,49.5 14.2,46.64 14.2,40.24 v14,40.04 13.56,39.6 10.6,39.6 7.97,42.23 JP17.2 4.93,42.23 4,41.3 4,36.67 JP2.1 | 21.6,49.5 21.5,49.6 v21.5,49.9
SDA_J
  Top 0.254: JP12.1 8.95,7.18 U1.3
V+
  Top 0.254: C15.1 12.2,15.8 8.95,12.55 U1.4 10.6,10.66 C25.1
  Top 0.406: U7.5 13.05,14.25 C15.1 4.05,24.8 C18.1 XB2.1
VCC
  Top 0.254: 12.7,47.75 12.7,47.85 C12.1 13.65,47 13.65,45.8 | HMC5883.4 13.05,36.15 12.6,36.6 12.6,37.1 | MS5611.1 18.93,57.08 18.27,56.42 | 18.27,56.42 C14.1 16.65,56.25 16,55.6 16,52.09 U6.5 | MS5611.2 18.88,55.83 18.27,56.42 | 16,40.8 16.05,40.75 HMC5883.13 | 13.7,40.8 16,40.8 | 13.7,40.8 12.1,39.2 12.1,38.4 12.6,37.9 12.6,37.1 | HMC5883.2 12.65,37.15 12.6,37.1 | 13.65,45.8 13.65,40.85 13.7,40.8 | MPU6050.8 19.65,46.25 C3.1 13.7,45.85 13.65,45.8 | MPU6050.13 21.65,42.2 C4.1 21.05,40.8 16,40.8
  Top 0.406: C23.1 11.15,49.3 12.7,49.3 | U6.5 14.35,50.15 13.5,49.3 12.7,49.3 | C12.1 12.75,49.25 12.7,49.3
VDD
  Bottom 0.406: C19.1 27.05,20.7 27.05,21.2 | U8.5 27.05,21.2 | UBLOX.23 31.25,21.2 | 31.25,21.2 C27.1 | 27.05,21.2 31.25,21.2
XBEE_RX
  Top 0.254: R8.1 32.37,38.75 JP11.3
XBEE_RX_J
  Bottom 0.406: XB2.3 2.9,23.2 11.7,23.2 17.6,17.3 17.6,11.9 26.8,2.7 JP1.1
XBEE_TX
  Top 0.254: R7.1 34.4,37 34.4,36.71 JP11.4
XBEE_TX_J
  Bottom 0.406: XB2.2 2.9,24 12,24 18.4,17.6 18.4,12.3 25.6,5.1 28,5.1 29.83,3.27 JP1.2

### Text on the board
tPlace: +3.3 | RG6 | RE5 | RG7 | RG8 | GND
tNames: + | +5V | v4 | GND | SDA | SCL